# Altium schematic sheet 2_ADSTM32_MCU.SchDoc
size A; SheetNumber: 3; SheetTotal: 4
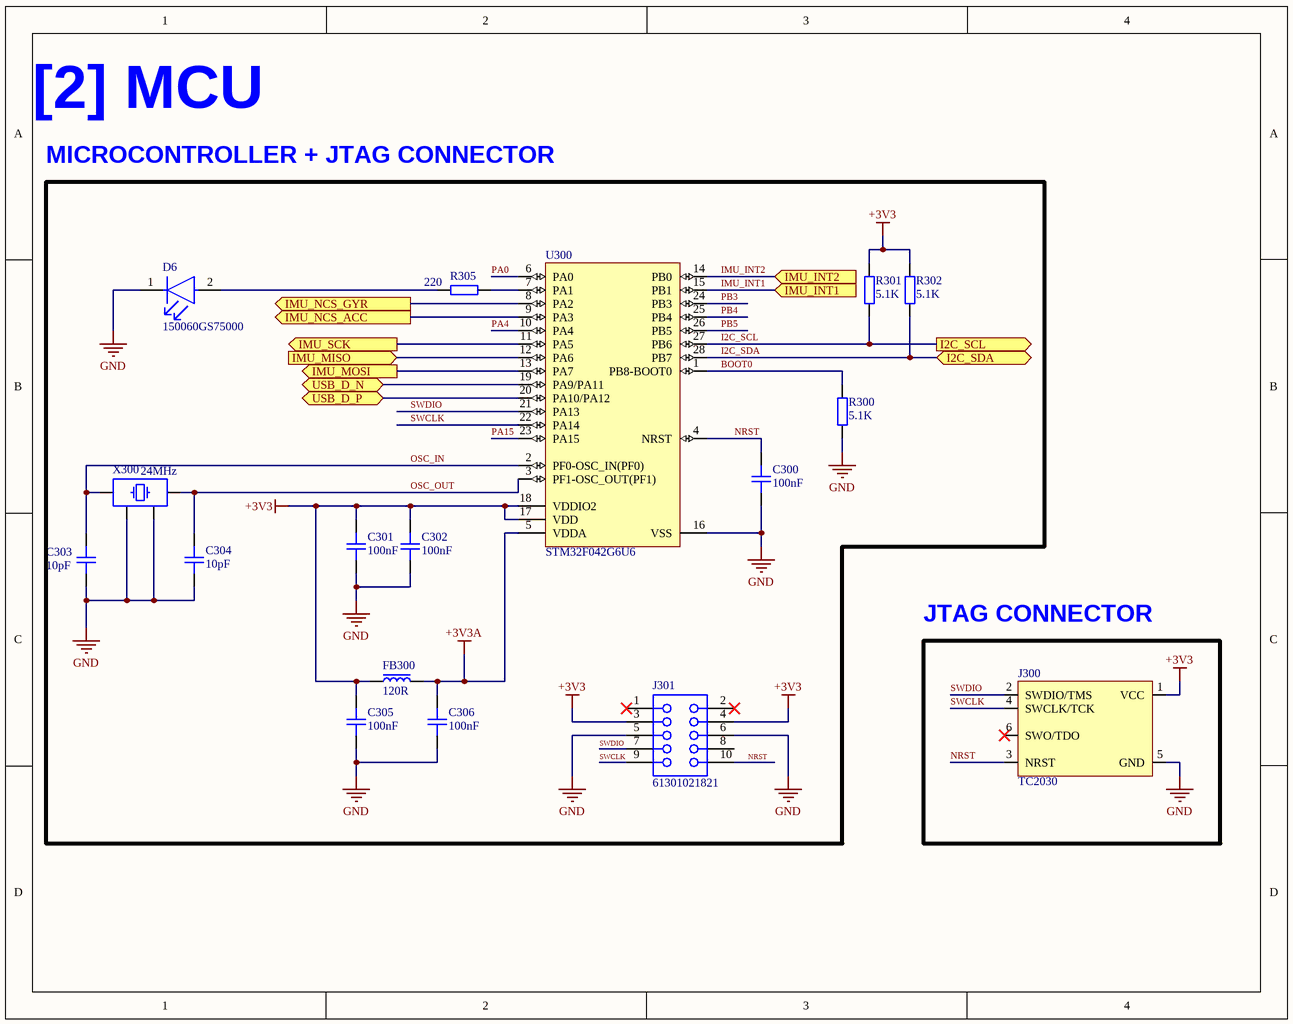
[diagram p0: 2_ADSTM32_MCU.SchDoc]

## Parts
C300  100nF  [CAP_0603]
C301  100nF  [CAP_0603]
C302  100nF  [CAP_0603]
C303  10pF  [CAP_0603]
C304  10pF  [CAP_0603]
C305  100nF  [CAP_0603]
C306  100nF  [CAP_0603]
D6  150060GS75000  [FP-150060GS75000-MFG]
FB300  120R  [FB_0603]
J300  TC2030  [TC2030-FP]  (no BOM)
J301  61301021821  [61301021821]
R300  5.1K  [RES_0603]
R301  5.1K  [RES_0603]
R302  5.1K  [RES_0603]
R305  220  [RES_0603]
U300  STM32F042G6U6  [STM-UFQFPN28_V]
X300  24MHz  [XTAL_3225]

## Ports
I2C_SCL (out, see 0_ADSTM32_Overview[3C], 3_ADSTM32_Peripheral[3B]), I2C_SDA (bidir, see 0_ADSTM32_Overview[3B], 3_ADSTM32_Peripheral[3B]), IMU_INT1 (in, see 0_ADSTM32_Overview[3B], 3_ADSTM32_Peripheral[3C]), IMU_INT2 (in, see 0_ADSTM32_Overview[3B], 3_ADSTM32_Peripheral[3C]), IMU_MISO (in, see 0_ADSTM32_Overview[3B], 3_ADSTM32_Peripheral[1C]), IMU_MOSI (out, see 0_ADSTM32_Overview[3B], 3_ADSTM32_Peripheral[1C]), IMU_NCS_ACC (out, see 0_ADSTM32_Overview[3B], 3_ADSTM32_Peripheral[1C]), IMU_NCS_GYR (out, see 0_ADSTM32_Overview[3B], 3_ADSTM32_Peripheral[1C]), IMU_SCK (out, see 0_ADSTM32_Overview[3B], 3_ADSTM32_Peripheral[1C]), USB_D_N (bidir, see 0_ADSTM32_Overview[2B], 1_ADSTM32_Power[2B]), USB_D_P (bidir, see 0_ADSTM32_Overview[2B], 1_ADSTM32_Power[2B])

## Nets
+3V3: C301.2 C302.2 C305.2 FB300.1 J300.1(VCC) J301.3 J301.4 R301.1 R302.1 U300.17(VDD) U300.18(VDDIO2)
+3V3A: C306.2 FB300.2 U300.5(VDDA)
GND: C300.1 C301.1 C302.1 C303.1 C304.1 C305.1 C306.1 D6.1(C) J300.5(GND) J301.5 J301.6 R300.2 U300.16(VSS) X300.2 X300.4
BOOT0: R300.1 U300.1(PB8-BOOT0)
I2C_SCL: R301.2 U300.27(PB6) ; port I2C_SCL
I2C_SDA: R302.2 U300.28(PB7) ; port I2C_SDA
IMU_INT1: U300.15(PB1) ; port IMU_INT1
IMU_INT2: U300.14(PB0) ; port IMU_INT2
IMU_MISO: U300.12(PA6) ; port IMU_MISO
IMU_MOSI: U300.13(PA7) ; port IMU_MOSI
IMU_NCS_ACC: U300.9(PA3) ; port IMU_NCS_ACC
IMU_NCS_GYR: U300.8(PA2) ; port IMU_NCS_GYR
IMU_SCK: U300.11(PA5) ; port IMU_SCK
NRST: C300.2 J300.3(NRST) J301.10 U300.4(NRST)
OSC_IN: C303.2 U300.2(PF0-OSC_IN(PF0)) X300.1
OSC_OUT: C304.2 U300.3(PF1-OSC_OUT(PF1)) X300.3
PA0: U300.6(PA0)
PA4: U300.10(PA4)
PA15: U300.23(PA15)
PB3: U300.24(PB3)
PB4: U300.25(PB4)
PB5: U300.26(PB5)
SWCLK: J300.4(SWCLK/TCK) J301.9 U300.22(PA14)
SWDIO: J300.2(SWDIO/TMS) J301.7 U300.21(PA13)
USB_D_N: U300.19(PA9/PA11) ; port USB_D_N
USB_D_P: U300.20(PA10/PA12) ; port USB_D_P
NetD6_2: D6.2(A) R305.2
NetR305_1: R305.1 U300.7(PA1)

Not connected (* = marked no-connect by the designer): J300 6(SWO/TDO)*; J301 1* 2* 8

## Notes on the sheet
- [2] MCU
- MICROCONTROLLER + JTAG CONNECTOR
- JTAG CONNECTOR

## Library data of the parts
C300-C306 = CAP_0603_16V: Capacitor SMD 0603 16V
D6 = CMP-1426-00002-2: LED GREEN CLEAR 0603 SMD; Viewing Angle: 140°; Forward Current: 30mA; Dominant Wavelength: 520nm; Luminous Intensity: 430mcd; Lens Size: 0.7mm; Forward Voltage: 3.2V; Test Current: 20mA; Lens Color: Colorless; Case Code (Imperial): 0603; Case/Package: 0603; Case Code (Metric): 1608; Length: 1.6mm; Lens Style: Clear; Height: 0.8mm; RoHS Compliant: Yes; Package Quantity: 1; Max Operating Temperature: 85°C; Mount: Surface Mount; Wavelength: 520nm; Width: 0.8mm; Lens Transparency: Clear; Packaging: Cut Tape; Color: Green; Lead Free: Lead Free; Min Operating Temperature: -40°C; Series: WL-SMCW
FB300 = FB_0603: Ferrite Bead SMD 0603
J300 = TC2030: Tag-Connect No-Solder SWD Debug Connector DO NOT PLACE; Manufacturer: Tag-Connect; Manufacturer Part Number: TC2030
J301 = CMP-1502-01334-2: NexarPartId: 18818164; Contact Resistance: 20mΩ; Current Rating: 3A; Row Spacing: 2.54mm; Gender: Female; Number of Contacts: 10; Operating Supply Voltage: 250V; Insulation Resistance: 1GΩ; Connector Type: Header, Socket; Termination: Solder; Max Operating Temperature: 125°C; Number of Pins: 10; REACH SVHC: Unknown; Height: 8.6mm; Flammability Rating: UL94 V-0; Number of Rows: 2; Mount: Through Hole; Housing Material: PBT; RoHS: Compliant; Orientation: Vertical; Pitch: 2.54mm; Contact Plating: Gold; Voltage Rating: 250V; Color: Black; Width: 13.2mm; Length: 5.08mm; Min Operating Temperature: -40°C; Lead Pitch: 2.54mm; Number of Positions: 10; Contact Gender: Female; Contact Material: Copper
R300-R302 R305 = RES_0603: Resistor SMD 0603; Manufacturer: *; Manufacturer Part Number: *; Distributor Link: *
U300 = CMP-0304-00112-2: ARM Cortex-M0 32-bit MCU, 32 KB Flash, 6 KB Internal RAM, 24 I/Os, 28-Pin UFQFPN, -40 to 85 degC, Tray; Manufacturer: STMicroelectronics; FLASH Size (Prog) (kB): 32; I/Os (High Current): 24; Internal RAM Size (kB): 6; Supply Voltage(Vcc) min (V): 2; Operating Frequency(F) (Processor speed) (MHz): 48; Core: ARM Cortex-M0; PartNumber: STM32F042G6U6; Packing: Tray; Package Description: 28-Pin Ultra Thin Fine Pitch Quad Flat No-Lead, 4 x 4 x 0.6 mm Body, 0.5 mm Pitch; ComponentLink2Description: Datasheet; ComponentLink1Description: Manufacturer URL; Package Reference: UFQFPN28; DatasheetVersion: Rev. 5; ComponentLink1URL: http://www.st.com/; ComponentLink2URL: http://www.st.com/st-web-ui/static/active/en/resource/technical/document/datasheet/DM00105814.pdf; Mounting Technology: Surface Mount
X300 = TSX-3225_24.0000MF15X-AC: Crystal SMD 24MHz 10PPM 7pF 3225; Manufacturer: Epson; Manufacturer Part Number: TSX-3225 24.0000MF15X-AC